# EasyEDA schematic 1-Schematic_Macro Pad.json

## Sheets
1 Sheet_1: TITLE: Sheet_1; REV: 2.0; Date: 2022-10-05; Sheet: 1/2; Drawn By: Bramble; Company: Future Gadgets Lab
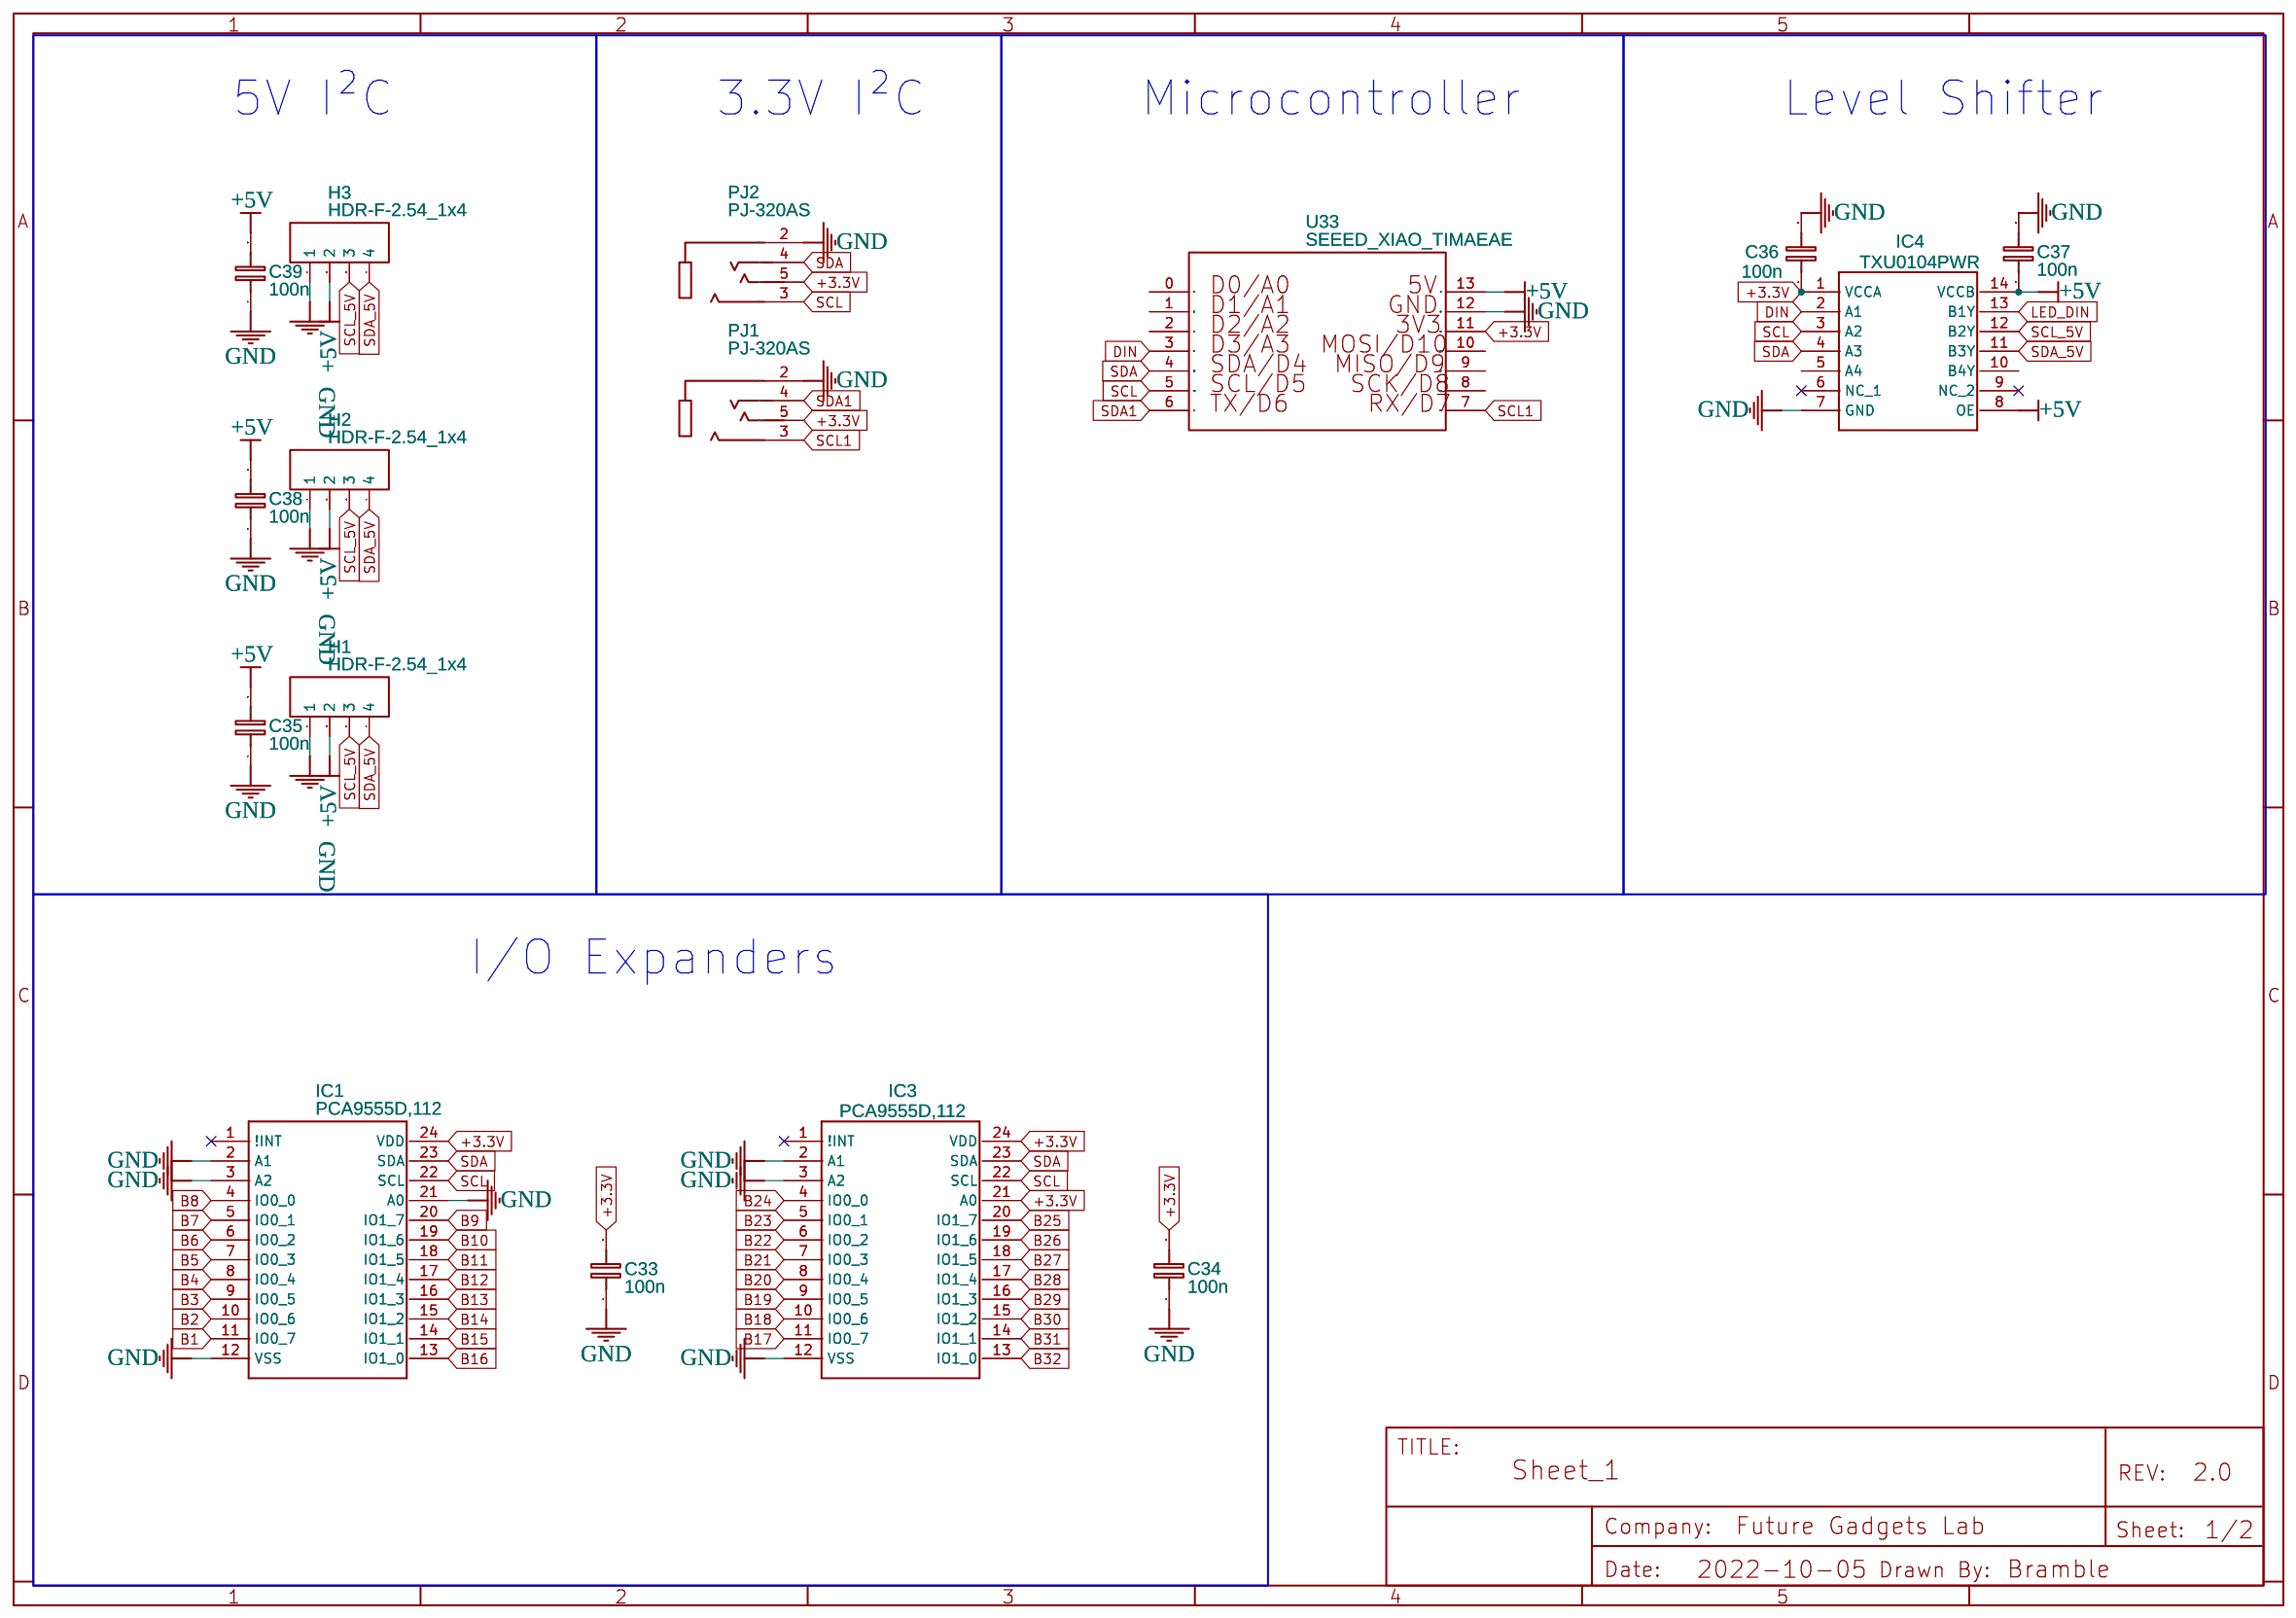
[diagram p0: Sheet_1]
2 Sheet_2: TITLE: Sheet_2; Date: 2022-10-09; Sheet: 2/2
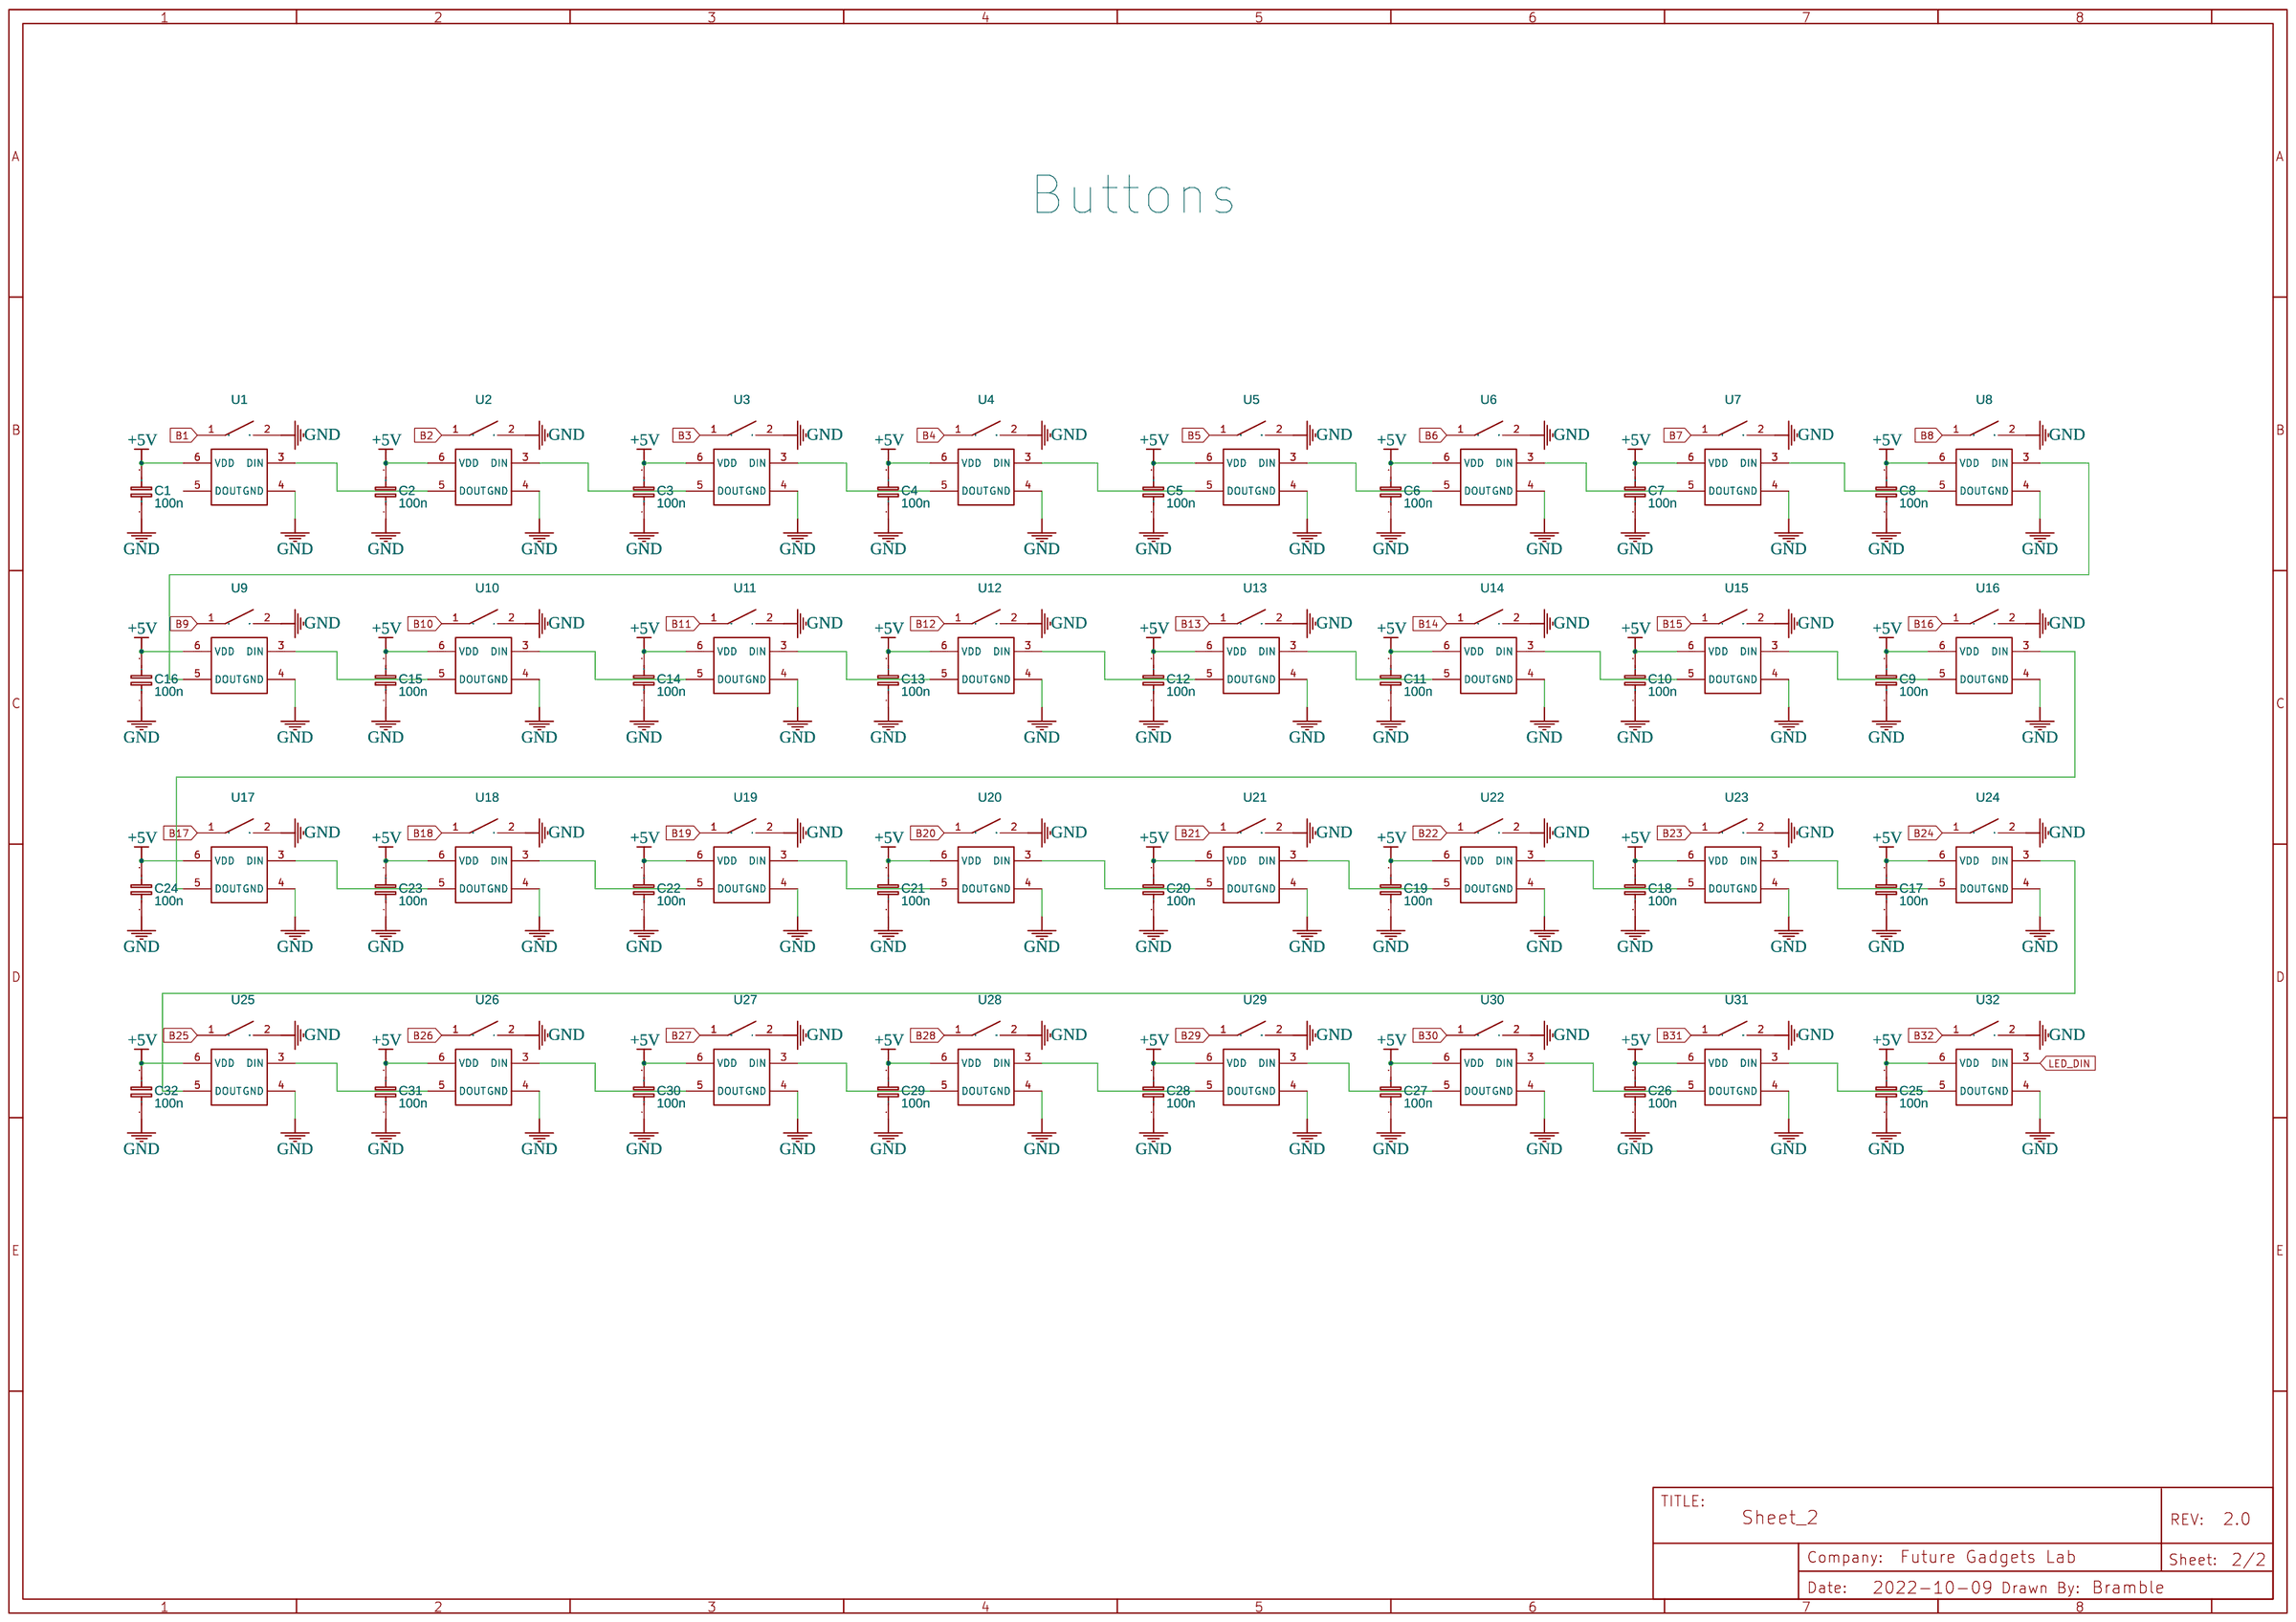
[diagram p1: Sheet_2]

## Parts
sheet Sheet_1
C33  100n  [C0603]
C34  100n  [C0603]
C35  100n  [C0603]
C36  100n  [C0603]
C37  100n  [C0603]
C38  100n  [C0603]
C39  100n  [C0603]
H1  HDR-F-2.54_1x4  [HDR-F-2.54_1X4]
H2  HDR-F-2.54_1x4  [HDR-F-2.54_1X4]
H3  HDR-F-2.54_1x4  [HDR-F-2.54_1X4]
IC1  PCA9555D,112  [SOIC127P1032X265-24N]
IC3  PCA9555D,112  [SOIC127P1032X265-24N]
IC4  TXU0104PWR  [SOP65P640X120-14N]
PJ1  PJ-320AS  [AUDIO-TH_HAOYU_PJ-320AS]
PJ2  PJ-320AS  [AUDIO-TH_HAOYU_PJ-320AS]
U33  SEEED_XIAO_TIMAEAE  [SEEED_XIAO_IM]
sheet Sheet_2
C1  100n  [C0603]
C2  100n  [C0603]
C3  100n  [C0603]
C4  100n  [C0603]
C5  100n  [C0603]
C6  100n  [C0603]
C7  100n  [C0603]
C8  100n  [C0603]
C9  100n  [C0603]
C10  100n  [C0603]
C11  100n  [C0603]
C12  100n  [C0603]
C13  100n  [C0603]
C14  100n  [C0603]
C15  100n  [C0603]
C16  100n  [C0603]
C17  100n  [C0603]
C18  100n  [C0603]
C19  100n  [C0603]
C20  100n  [C0603]
C21  100n  [C0603]
C22  100n  [C0603]
C23  100n  [C0603]
C24  100n  [C0603]
C25  100n  [C0603]
C26  100n  [C0603]
C27  100n  [C0603]
C28  100n  [C0603]
C29  100n  [C0603]
C30  100n  [C0603]
C31  100n  [C0603]
C32  100n  [C0603]
U1  Hotswap MX/Choc 1*1  [HOTSWAP_MX_CHOC_1*1]
U2  Hotswap MX/Choc 1*1  [HOTSWAP_MX_CHOC_1*1]
U3  Hotswap MX/Choc 1*1  [HOTSWAP_MX_CHOC_1*1]
U4  Hotswap MX/Choc 1*1  [HOTSWAP_MX_CHOC_1*1]
U5  Hotswap MX/Choc 1*1  [HOTSWAP_MX_CHOC_1*1]
U6  Hotswap MX/Choc 1*1  [HOTSWAP_MX_CHOC_1*1]
U7  Hotswap MX/Choc 1*1  [HOTSWAP_MX_CHOC_1*1]
U8  Hotswap MX/Choc 1*1  [HOTSWAP_MX_CHOC_1*1]
U9  Hotswap MX/Choc 1*1  [HOTSWAP_MX_CHOC_1*1]
U10  Hotswap MX/Choc 1*1  [HOTSWAP_MX_CHOC_1*1]
U11  Hotswap MX/Choc 1*1  [HOTSWAP_MX_CHOC_1*1]
U12  Hotswap MX/Choc 1*1  [HOTSWAP_MX_CHOC_1*1]
U13  Hotswap MX/Choc 1*1  [HOTSWAP_MX_CHOC_1*1]
U14  Hotswap MX/Choc 1*1  [HOTSWAP_MX_CHOC_1*1]
U15  Hotswap MX/Choc 1*1  [HOTSWAP_MX_CHOC_1*1]
U16  Hotswap MX/Choc 1*1  [HOTSWAP_MX_CHOC_1*1]
U17  Hotswap MX/Choc 1*1  [HOTSWAP_MX_CHOC_1*1]
U18  Hotswap MX/Choc 1*1  [HOTSWAP_MX_CHOC_1*1]
U19  Hotswap MX/Choc 1*1  [HOTSWAP_MX_CHOC_1*1]
U20  Hotswap MX/Choc 1*1  [HOTSWAP_MX_CHOC_1*1]
U21  Hotswap MX/Choc 1*1  [HOTSWAP_MX_CHOC_1*1]
U22  Hotswap MX/Choc 1*1  [HOTSWAP_MX_CHOC_1*1]
U23  Hotswap MX/Choc 1*1  [HOTSWAP_MX_CHOC_1*1]
U24  Hotswap MX/Choc 1*1  [HOTSWAP_MX_CHOC_1*1]
U25  Hotswap MX/Choc 1*1  [HOTSWAP_MX_CHOC_1*1]
U26  Hotswap MX/Choc 1*1  [HOTSWAP_MX_CHOC_1*1]
U27  Hotswap MX/Choc 1*1  [HOTSWAP_MX_CHOC_1*1]
U28  Hotswap MX/Choc 1*1  [HOTSWAP_MX_CHOC_1*1]
U29  Hotswap MX/Choc 1*1  [HOTSWAP_MX_CHOC_1*1]
U30  Hotswap MX/Choc 1*1  [HOTSWAP_MX_CHOC_1*1]
U31  Hotswap MX/Choc 1*1  [HOTSWAP_MX_CHOC_1*1]
U32  Hotswap MX/Choc 1*1  [HOTSWAP_MX_CHOC_1*1]

## Library data of the parts
C1-C39 = C_0603_EU: Contributor: LCEDA_Lib
H1-H3 = HDR-F-2.54_1x4: Supplier Part: C225501; Supplier: LCSC; Contributor: LCEDA_Lib
IC1 IC3 = PCA9555D,112: Contributor: Bramble
IC4 = TXU0104PWR: Contributor: Bramble
PJ1 PJ2 = PJ-320AS: Supplier: LCSC; Supplier Part: C2939182; Manufacturer: HOOYA(香港皓宇); link: https://atta.szlcsc.com/upload/public/pdf/source/20220617/DBC4709FB9CB69A8BFEB2AD0F07AA409.pdf; Contributor: lcsc
U33 = SEEED_XIAO_TIMAEAE: Manufacturer: Seeedstudio; Manufacturer Part: 102010428; link: https://www.seeedstudio.com/XIAO-RP2040-v1-0-p-5026.html; Contributor: pthompson8594
U1-U32 = Hotswap MX/Choc 1*1: Contributor: n.chandanson

## Nets
+3.3V: C33.2 C34.2 C36.1 IC1.24(VDD) IC3.21(A0) IC3.24(VDD) IC4.1(VCCA) PJ1.5 PJ2.5 U33.11(3V3)
+5V: C1.2 C2.2 C3.2 C4.2 C5.2 C6.2 C7.2 C8.2 C9.2 C10.2 C11.2 C12.2 C13.2 C14.2 C15.2 C16.2 C17.2 C18.2 C19.2 C20.2 C21.2 C22.2 C23.2 C24.2 C25.2 C26.2 C27.2 C28.2 C29.2 C30.2 C31.2 C32.2 C35.2 C37.1 C38.2 C39.2 H1.2 H2.2 H3.2 IC4.8(OE) IC4.14(VCCB) U1.6(VDD) U2.6(VDD) U3.6(VDD) U4.6(VDD) U5.6(VDD) U6.6(VDD) U7.6(VDD) U8.6(VDD) U9.6(VDD) U10.6(VDD) U11.6(VDD) U12.6(VDD) U13.6(VDD) U14.6(VDD) U15.6(VDD) U16.6(VDD) U17.6(VDD) U18.6(VDD) U19.6(VDD) U20.6(VDD) U21.6(VDD) U22.6(VDD) U23.6(VDD) U24.6(VDD) U25.6(VDD) U26.6(VDD) U27.6(VDD) U28.6(VDD) U29.6(VDD) U30.6(VDD) U31.6(VDD) U32.6(VDD) U33.13(SV)
GND: C1.1 C2.1 C3.1 C4.1 C5.1 C6.1 C7.1 C8.1 C9.1 C10.1 C11.1 C12.1 C13.1 C14.1 C15.1 C16.1 C17.1 C18.1 C19.1 C20.1 C21.1 C22.1 C23.1 C24.1 C25.1 C26.1 C27.1 C28.1 C29.1 C30.1 C31.1 C32.1 C33.1 C34.1 C35.1 C36.2 C37.2 C38.1 C39.1 H1.1 H2.1 H3.1 IC1.2(A1) IC1.3(A2) IC1.12(VSS) IC1.21(A0) IC3.2(A1) IC3.3(A2) IC3.12(VSS) IC4.7(GND) PJ1.2 PJ2.2 U1.2(SW2) U1.4(GND) U2.2(SW2) U2.4(GND) U3.2(SW2) U3.4(GND) U4.2(SW2) U4.4(GND) U5.2(SW2) U5.4(GND) U6.2(SW2) U6.4(GND) U7.2(SW2) U7.4(GND) U8.2(SW2) U8.4(GND) U9.2(SW2) U9.4(GND) U10.2(SW2) U10.4(GND) U11.2(SW2) U11.4(GND) U12.2(SW2) U12.4(GND) U13.2(SW2) U13.4(GND) U14.2(SW2) U14.4(GND) U15.2(SW2) U15.4(GND) U16.2(SW2) U16.4(GND) U17.2(SW2) U17.4(GND) U18.2(SW2) U18.4(GND) U19.2(SW2) U19.4(GND) U20.2(SW2) U20.4(GND) U21.2(SW2) U21.4(GND) U22.2(SW2) U22.4(GND) U23.2(SW2) U23.4(GND) U24.2(SW2) U24.4(GND) U25.2(SW2) U25.4(GND) U26.2(SW2) U26.4(GND) U27.2(SW2) U27.4(GND) U28.2(SW2) U28.4(GND) U29.2(SW2) U29.4(GND) U30.2(SW2) U30.4(GND) U31.2(SW2) U31.4(GND) U32.2(SW2) U32.4(GND) U33.12(GND)
B1: IC1.11(IO0_7) U1.1(SW1)
B2: IC1.10(IO0_6) U2.1(SW1)
B3: IC1.9(IO0_5) U3.1(SW1)
B4: IC1.8(IO0_4) U4.1(SW1)
B5: IC1.7(IO0_3) U5.1(SW1)
B6: IC1.6(IO0_2) U6.1(SW1)
B7: IC1.5(IO0_1) U7.1(SW1)
B8: IC1.4(IO0_0) U8.1(SW1)
B9: IC1.20(IO1_7) U9.1(SW1)
B10: IC1.19(IO1_6) U10.1(SW1)
B11: IC1.18(IO1_5) U11.1(SW1)
B12: IC1.17(IO1_4) U12.1(SW1)
B13: IC1.16(IO1_3) U13.1(SW1)
B14: IC1.15(IO1_2) U14.1(SW1)
B15: IC1.14(IO1_1) U15.1(SW1)
B16: IC1.13(IO1_0) U16.1(SW1)
B17: IC3.11(IO0_7) U17.1(SW1)
B18: IC3.10(IO0_6) U18.1(SW1)
B19: IC3.9(IO0_5) U19.1(SW1)
B20: IC3.8(IO0_4) U20.1(SW1)
B21: IC3.7(IO0_3) U21.1(SW1)
B22: IC3.6(IO0_2) U22.1(SW1)
B23: IC3.5(IO0_1) U23.1(SW1)
B24: IC3.4(IO0_0) U24.1(SW1)
B25: IC3.20(IO1_7) U25.1(SW1)
B26: IC3.19(IO1_6) U26.1(SW1)
B27: IC3.18(IO1_5) U27.1(SW1)
B28: IC3.17(IO1_4) U28.1(SW1)
B29: IC3.16(IO1_3) U29.1(SW1)
B30: IC3.15(IO1_2) U30.1(SW1)
B31: IC3.14(IO1_1) U31.1(SW1)
B32: IC3.13(IO1_0) U32.1(SW1)
DIN: IC4.2(A1) U33.3(D3/A3)
LED_DIN: IC4.13(B1Y) U32.3(DIN)
SCL: IC1.22(SCL) IC3.22(SCL) IC4.3(A2) PJ2.3 U33.5(SCL/D5)
SCL1: PJ1.3 U33.7(RX/D7)
SCL_5V: H1.3 H2.3 H3.3 IC4.12(B2Y)
SDA: IC1.23(SDA) IC3.23(SDA) IC4.4(A3) PJ2.4 U33.4(SDA/D4)
SDA1: PJ1.4 U33.6(TX/D6)
SDA_5V: H1.4 H2.4 H3.4 IC4.11(B3Y)
Net-(U1-3): U1.3(DIN) U2.5(DOUT)
Net-(U2-3): U2.3(DIN) U3.5(DOUT)
Net-(U3-3): U3.3(DIN) U4.5(DOUT)
Net-(U4-3): U4.3(DIN) U5.5(DOUT)
Net-(U5-3): U5.3(DIN) U6.5(DOUT)
Net-(U6-3): U6.3(DIN) U7.5(DOUT)
Net-(U7-3): U7.3(DIN) U8.5(DOUT)
Net-(U8-3): U8.3(DIN) U9.5(DOUT)
Net-(U9-3): U9.3(DIN) U10.5(DOUT)
Net-(U10-3): U10.3(DIN) U11.5(DOUT)
Net-(U11-3): U11.3(DIN) U12.5(DOUT)
Net-(U12-3): U12.3(DIN) U13.5(DOUT)
Net-(U13-3): U13.3(DIN) U14.5(DOUT)
Net-(U14-3): U14.3(DIN) U15.5(DOUT)
Net-(U15-3): U15.3(DIN) U16.5(DOUT)
Net-(U16-3): U16.3(DIN) U17.5(DOUT)
Net-(U17-3): U17.3(DIN) U18.5(DOUT)
Net-(U18-3): U18.3(DIN) U19.5(DOUT)
Net-(U19-3): U19.3(DIN) U20.5(DOUT)
Net-(U20-3): U20.3(DIN) U21.5(DOUT)
Net-(U21-3): U21.3(DIN) U22.5(DOUT)
Net-(U22-3): U22.3(DIN) U23.5(DOUT)
Net-(U23-3): U23.3(DIN) U24.5(DOUT)
Net-(U24-3): U24.3(DIN) U25.5(DOUT)
Net-(U25-3): U25.3(DIN) U26.5(DOUT)
Net-(U26-3): U26.3(DIN) U27.5(DOUT)
Net-(U27-3): U27.3(DIN) U28.5(DOUT)
Net-(U28-3): U28.3(DIN) U29.5(DOUT)
Net-(U29-3): U29.3(DIN) U30.5(DOUT)
Net-(U30-3): U30.3(DIN) U31.5(DOUT)
Net-(U31-3): U31.3(DIN) U32.5(DOUT)

Not connected (* = marked no-connect by the designer): IC1 1(!INT)*; IC3 1(!INT)*; IC4 5(A4) 6(NC_1)* 9(NC_2)* 10(B4Y); U1 5(DOUT); U33 0(D0/A0) 1(D1/A1) 2(D2/A2) 8(SCK/D8) 9(MISO/D9) 10(MOSI/D10)

## Notes on the sheets
sheet 1
- 5V I²C
- 3.3V I²C
- Microcontroller
- Level Shifter
- I/O Expanders
sheet 2
- Buttons
